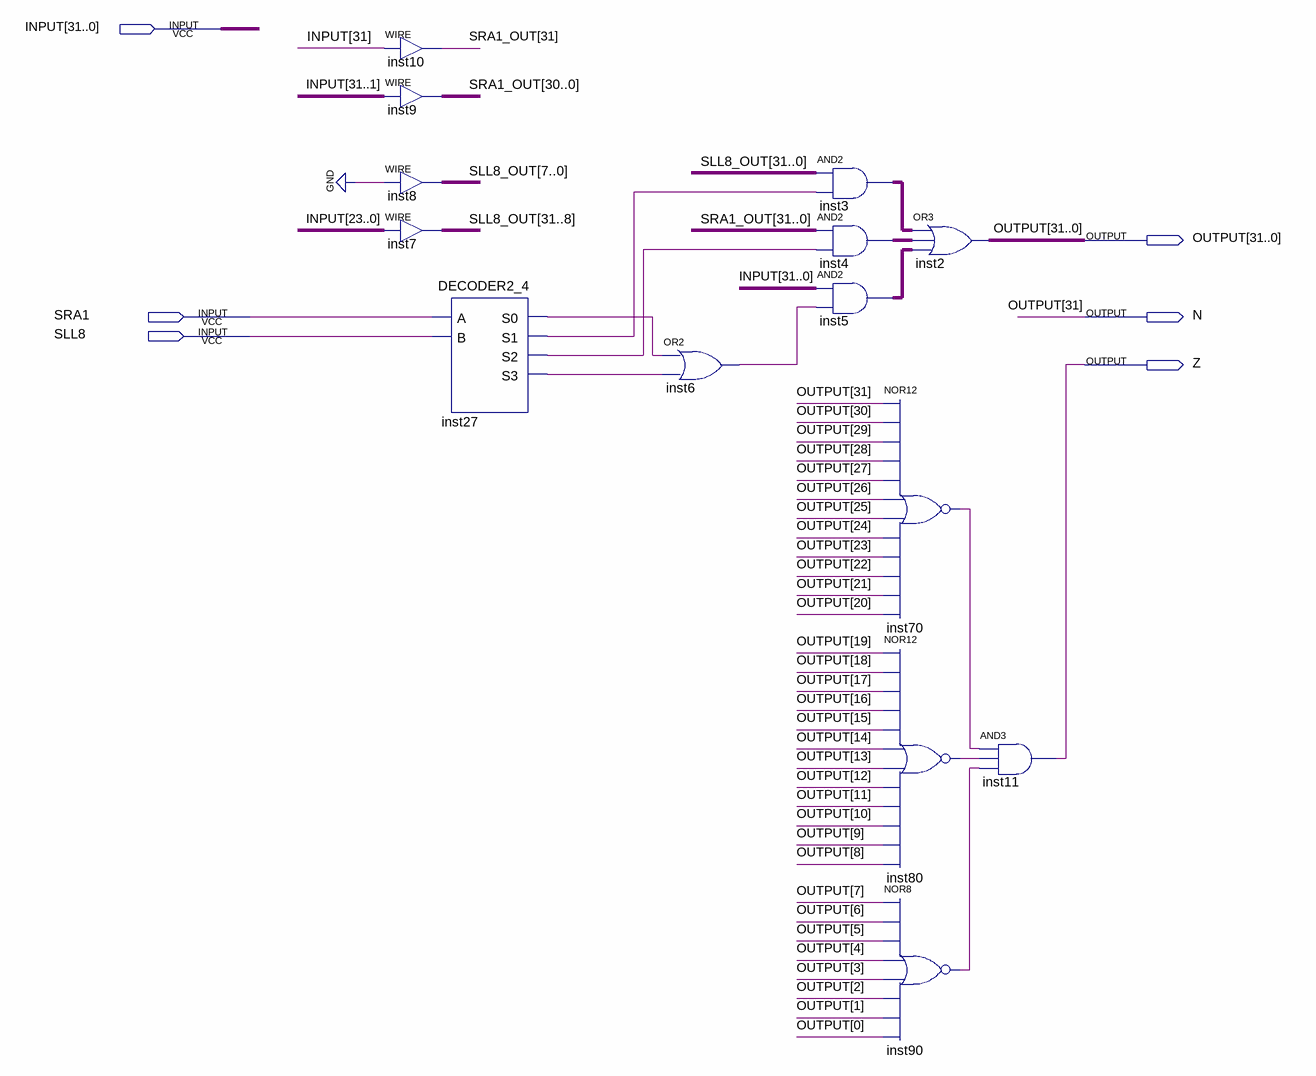
[diagram p0: schematic sheet]
// Quartus schematic SHIFTER.bdf as structural Verilog: 14 symbols, 6 pins
module SHIFTER (
  input  [31:0] INPUT,
  input  SRA1,
  input  SLL8,
  output [31:0] OUTPUT,
  output N,
  output Z
);

  wire inst6_out, inst27_s0, inst27_s1, inst27_s2, inst27_s3, inst70_out, inst80_out, inst90_out;
  wire [31:0] inst3_out, inst4_out, inst5_out, SLL8_OUT, SRA1_OUT;

  assign SRA1_OUT[31] = INPUT[31];  // WIRE inst10
  assign SRA1_OUT[30:0] = INPUT[31:1];  // WIRE inst9
  assign SLL8_OUT[7:0] = {8{1'b0}};  // WIRE inst8
  assign SLL8_OUT[31:8] = INPUT[23:0];  // WIRE inst7
  DECODER2_4 inst27 (.A(SRA1), .B(SLL8), .S0(inst27_s0), .S1(inst27_s1), .S2(inst27_s2), .S3(inst27_s3));
  or inst6 (inst6_out, inst27_s0, inst27_s3);
  assign inst3_out = SLL8_OUT & {32{inst27_s1}};  // AND2 inst3, 32 bits wide
  assign inst4_out = SRA1_OUT & {32{inst27_s2}};  // AND2 inst4, 32 bits wide
  assign inst5_out = INPUT & {32{inst6_out}};  // AND2 inst5, 32 bits wide
  nor inst70 (inst70_out, N, OUTPUT[30], OUTPUT[29], OUTPUT[28], OUTPUT[27], OUTPUT[26], OUTPUT[25], OUTPUT[24], OUTPUT[23], OUTPUT[22], OUTPUT[21], OUTPUT[20]);
  nor inst80 (inst80_out, OUTPUT[19], OUTPUT[18], OUTPUT[17], OUTPUT[16], OUTPUT[15], OUTPUT[14], OUTPUT[13], OUTPUT[12], OUTPUT[11], OUTPUT[10], OUTPUT[9], OUTPUT[8]);
  nor inst90 (inst90_out, OUTPUT[7], OUTPUT[6], OUTPUT[5], OUTPUT[4], OUTPUT[3], OUTPUT[2], OUTPUT[1], OUTPUT[0]);
  assign {N, OUTPUT[30:0]} = inst3_out | inst4_out | inst5_out;  // OR3 inst2, 32 bits wide
  and inst11 (Z, inst70_out, inst80_out, inst90_out);

  assign OUTPUT[31] = N;
endmodule
